# Altium schematic sheet 主控.SchDoc
size 381 x 241 mm
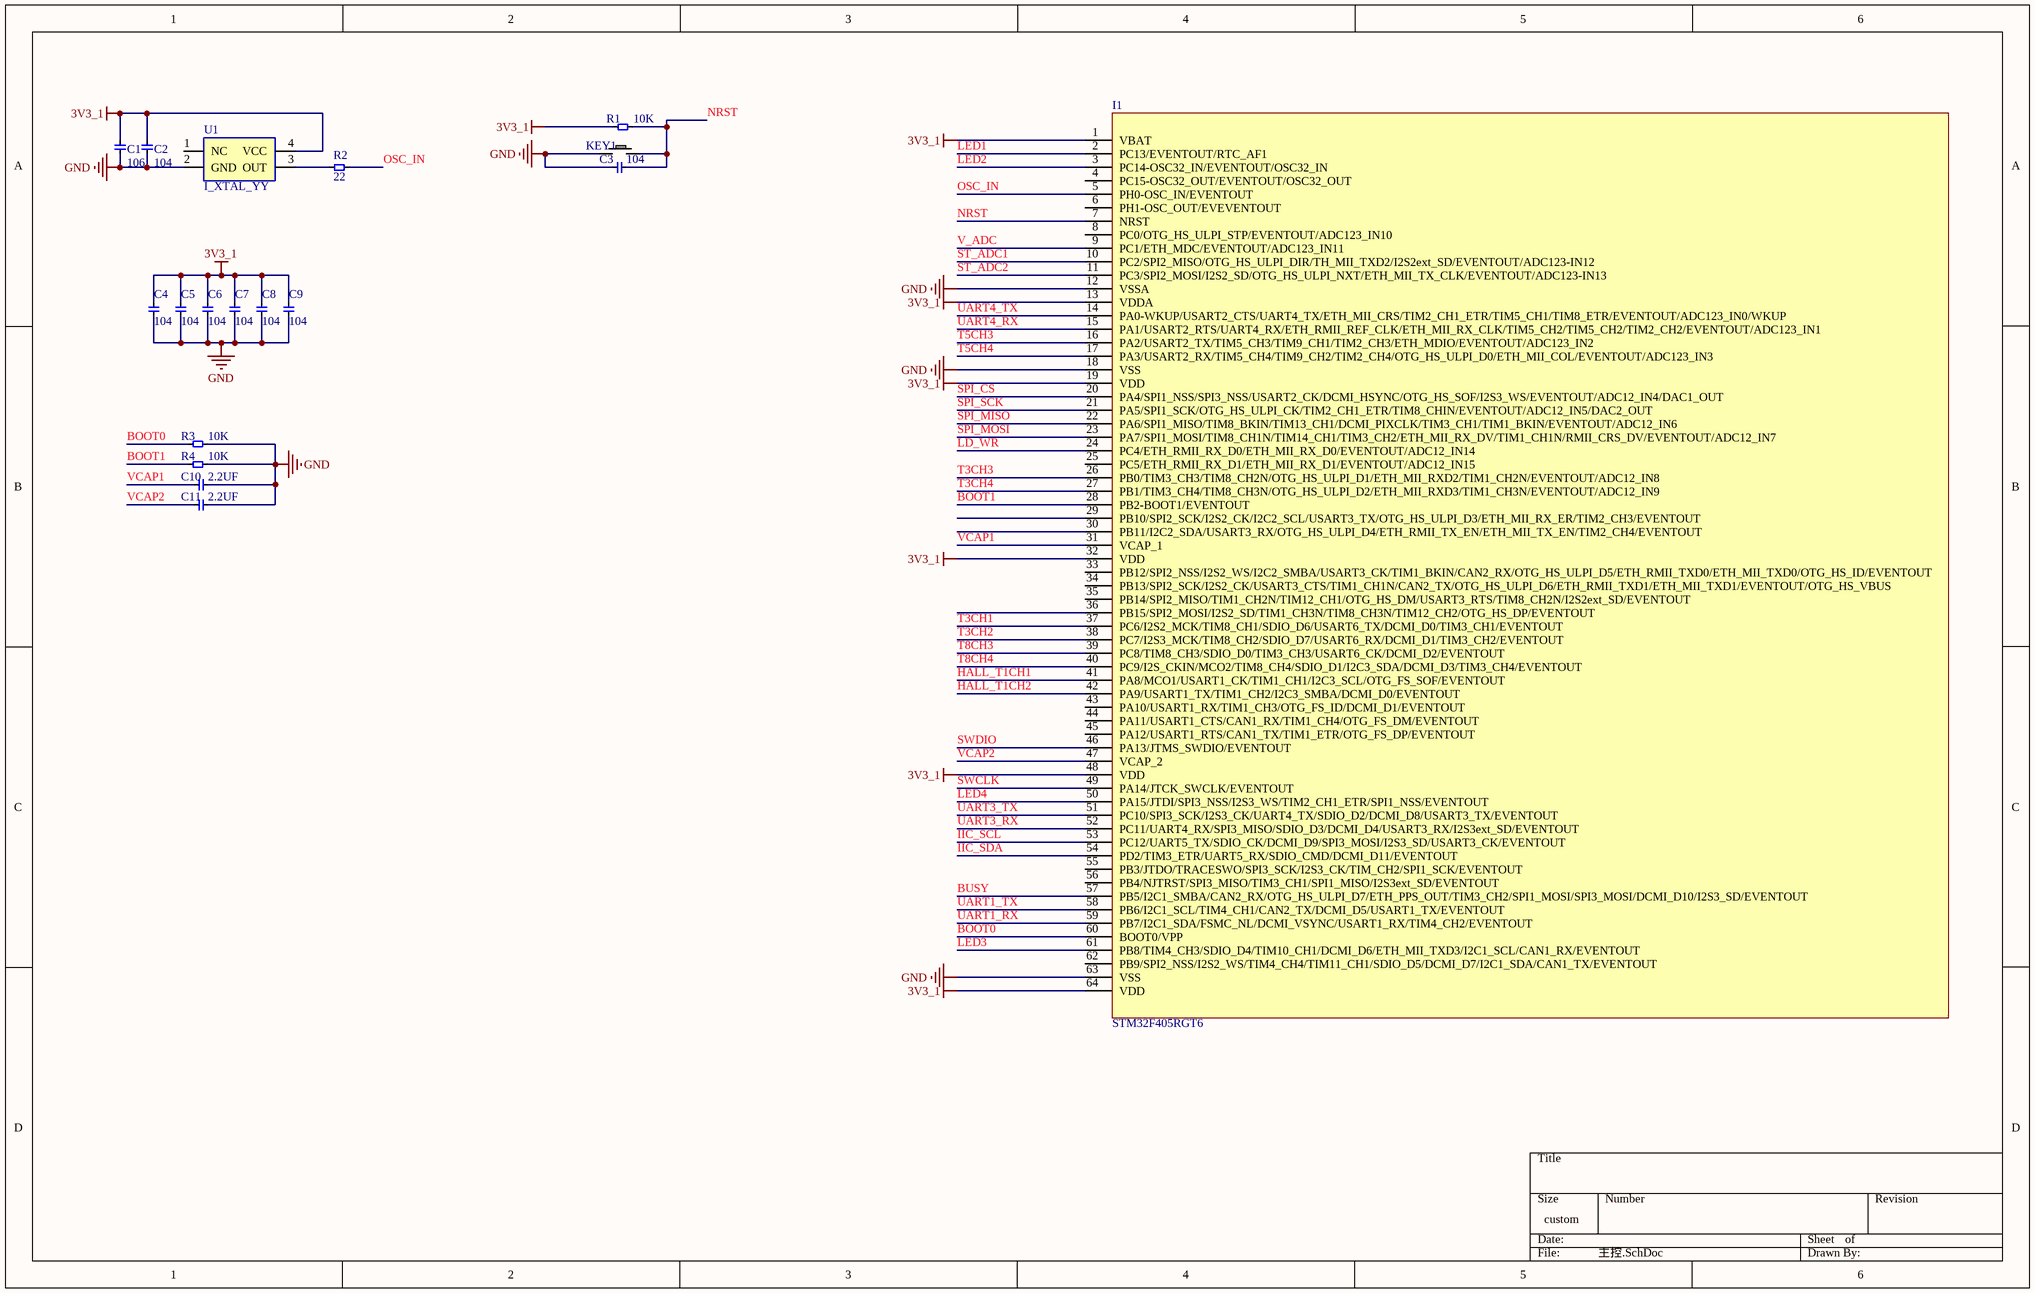
[diagram p0: 主控.SchDoc]

## Parts
C1  106  [C_0603]
C2  104  [C_0603]
C3  104  [C_0603]
C4  104  [C_0603]
C5  104  [C_0603]
C6  104  [C_0603]
C7  104  [C_0603]
C8  104  [C_0603]
C9  104  [C_0603]
C10  2.2UF  [C_0603]
C11  2.2UF  [C_0603]
I1  STM32F405RGT6  [I_LQFP-64]
KEY1  KEY  [按键_小四脚]  (value not drawn)
R1  10K  [R_0603]
R2  22  [R_0603]
R3  10K  [R_0603]
R4  10K  [R_0603]
U1  I_XTAL_YY  [I_XTAL_YYSMD_3.2X2.5]

## Nets
3V3_1: C1.2 C2.2 C4.2 C5.2 C6.2 C7.2 C8.2 C9.2 I1.1(VBAT) I1.13(VDDA) I1.19(VDD) I1.32(VDD) I1.48(VDD) I1.64(VDD) R1.1 U1.4(VCC)
GND: C1.1 C2.1 C3.2 C4.1 C5.1 C6.1 C7.1 C8.1 C9.1 C10.1 C11.1 I1.12(VSSA) I1.18(VSS) I1.63(VSS) KEY1.1 R3.2 R4.2 U1.2(GND)
BOOT0: I1.60(BOOT0/VPP) R3.1
BOOT1: I1.28(PB2-BOOT1/EVENTOUT) R4.1
BUSY: I1.57(PB5/I2C1_SMBA/CAN2_RX/OTG_HS_ULPI_D7/ETH_PPS_OUT/TIM3_CH2/SPI1_MOSI/SPI3_MOSI/DCMI_D10/I2S3_SD/EVENTOUT)
HALL_T1CH1: I1.41(PA8/MCO1/USART1_CK/TIM1_CH1/I2C3_SCL/OTG_FS_SOF/EVENTOUT)
HALL_T1CH2: I1.42(PA9/USART1_TX/TIM1_CH2/I2C3_SMBA/DCMI_D0/EVENTOUT)
IIC_SCL: I1.53(PC12/UART5_TX/SDIO_CK/DCMI_D9/SPI3_MOSI/I2S3_SD/USART3_CK/EVENTOUT)
IIC_SDA: I1.54(PD2/TIM3_ETR/UART5_RX/SDIO_CMD/DCMI_D11/EVENTOUT)
LD_WR: I1.24(PC4/ETH_RMII_RX_D0/ETH_MII_RX_D0/EVENTOUT/ADC12_IN14)
LED1: I1.2(PC13/EVENTOUT/RTC_AF1)
LED2: I1.3(PC14-OSC32_IN/EVENTOUT/OSC32_IN)
LED3: I1.61(PB8/TIM4_CH3/SDIO_D4/TIM10_CH1/DCMI_D6/ETH_MII_TXD3/I2C1_SCL/CAN1_RX/EVENTOUT)
LED4: I1.50(PA15/JTDI/SPI3_NSS/I2S3_WS/TIM2_CH1_ETR/SPI1_NSS/EVENTOUT)
NRST: C3.1 I1.7(NRST) KEY1.2 R1.2
OSC_IN: I1.5(PH0-OSC_IN/EVENTOUT) R2.2
SPI_CS: I1.20(PA4/SPI1_NSS/SPI3_NSS/USART2_CK/DCMI_HSYNC/OTG_HS_SOF/I2S3_WS/EVENTOUT/ADC12_IN4/DAC1_OUT)
SPI_MISO: I1.22(PA6/SPI1_MISO/TIM8_BKIN/TIM13_CH1/DCMI_PIXCLK/TIM3_CH1/TIM1_BKIN/EVENTOUT/ADC12_IN6)
SPI_MOSI: I1.23(PA7/SPI1_MOSI/TIM8_CH1N/TIM14_CH1/TIM3_CH2/ETH_MII_RX_DV/TIM1_CH1N/RMII_CRS_DV/EVENTOUT/ADC12_IN7)
SPI_SCK: I1.21(PA5/SPI1_SCK/OTG_HS_ULPI_CK/TIM2_CH1_ETR/TIM8_CHIN/EVENTOUT/ADC12_IN5/DAC2_OUT)
ST_ADC1: I1.10(PC2/SPI2_MISO/OTG_HS_ULPI_DIR/TH_MII_TXD2/I2S2ext_SD/EVENTOUT/ADC123-IN12)
ST_ADC2: I1.11(PC3/SPI2_MOSI/I2S2_SD/OTG_HS_ULPI_NXT/ETH_MII_TX_CLK/EVENTOUT/ADC123-IN13)
SWCLK: I1.49(PA14/JTCK_SWCLK/EVENTOUT)
SWDIO: I1.46(PA13/JTMS_SWDIO/EVENTOUT)
T3CH1: I1.37(PC6/I2S2_MCK/TIM8_CH1/SDIO_D6/USART6_TX/DCMI_D0/TIM3_CH1/EVENTOUT)
T3CH2: I1.38(PC7/I2S3_MCK/TIM8_CH2/SDIO_D7/USART6_RX/DCMI_D1/TIM3_CH2/EVENTOUT)
T3CH3: I1.26(PB0/TIM3_CH3/TIM8_CH2N/OTG_HS_ULPI_D1/ETH_MII_RXD2/TIM1_CH2N/EVENTOUT/ADC12_IN8)
T3CH4: I1.27(PB1/TIM3_CH4/TIM8_CH3N/OTG_HS_ULPI_D2/ETH_MII_RXD3/TIM1_CH3N/EVENTOUT/ADC12_IN9)
T5CH3: I1.16(PA2/USART2_TX/TIM5_CH3/TIM9_CH1/TIM2_CH3/ETH_MDIO/EVENTOUT/ADC123_IN2)
T5CH4: I1.17(PA3/USART2_RX/TIM5_CH4/TIM9_CH2/TIM2_CH4/OTG_HS_ULPI_D0/ETH_MII_COL/EVENTOUT/ADC123_IN3)
T8CH3: I1.39(PC8/TIM8_CH3/SDIO_D0/TIM3_CH3/USART6_CK/DCMI_D2/EVENTOUT)
T8CH4: I1.40(PC9/I2S_CKIN/MCO2/TIM8_CH4/SDIO_D1/I2C3_SDA/DCMI_D3/TIM3_CH4/EVENTOUT)
UART1_RX: I1.59(PB7/I2C1_SDA/FSMC_NL/DCMI_VSYNC/USART1_RX/TIM4_CH2/EVENTOUT)
UART1_TX: I1.58(PB6/I2C1_SCL/TIM4_CH1/CAN2_TX/DCMI_D5/USART1_TX/EVENTOUT)
UART3_RX: I1.52(PC11/UART4_RX/SPI3_MISO/SDIO_D3/DCMI_D4/USART3_RX/I2S3ext_SD/EVENTOUT)
UART3_TX: I1.51(PC10/SPI3_SCK/I2S3_CK/UART4_TX/SDIO_D2/DCMI_D8/USART3_TX/EVENTOUT)
UART4_RX: I1.15(PA1/USART2_RTS/UART4_RX/ETH_RMII_REF_CLK/ETH_MII_RX_CLK/TIM5_CH2/TIM5_CH2/TIM2_CH2/EVENTOUT/ADC123_IN1)
UART4_TX: I1.14(PA0-WKUP/USART2_CTS/UART4_TX/ETH_MII_CRS/TIM2_CH1_ETR/TIM5_CH1/TIM8_ETR/EVENTOUT/ADC123_IN0/WKUP)
V_ADC: I1.9(PC1/ETH_MDC/EVENTOUT/ADC123_IN11)
VCAP1: C10.2 I1.31(VCAP_1)
VCAP2: C11.2 I1.47(VCAP_2)
NetR2_1: R2.1 U1.3(OUT)

Not connected (* = marked no-connect by the designer): I1 4(PC15-OSC32_OUT/EVENTOUT/OSC32_OUT) 6(PH1-OSC_OUT/EVEVENTOUT) 8(PC0/OTG_HS_ULPI_STP/EVENTOUT/ADC123_IN10) 25(PC5/ETH_RMII_RX_D1/ETH_MII_RX_D1/EVENTOUT/ADC12_IN15) 29(PB10/SPI2_SCK/I2S2_CK/I2C2_SCL/USART3_TX/OTG_HS_ULPI_D3/ETH_MII_RX_ER/TIM2_CH3/EVENTOUT) 30(PB11/I2C2_SDA/USART3_RX/OTG_HS_ULPI_D4/ETH_RMII_TX_EN/ETH_MII_TX_EN/TIM2_CH4/EVENTOUT) 33(PB12/SPI2_NSS/I2S2_WS/I2C2_SMBA/USART3_CK/TIM1_BKIN/CAN2_RX/OTG_HS_ULPI_D5/ETH_RMII_TXD0/ETH_MII_TXD0/OTG_HS_ID/EVENTOUT) 34(PB13/SPI2_SCK/I2S2_CK/USART3_CTS/TIM1_CH1N/CAN2_TX/OTG_HS_ULPI_D6/ETH_RMII_TXD1/ETH_MII_TXD1/EVENTOUT/OTG_HS_VBUS) 35(PB14/SPI2_MISO/TIM1_CH2N/TIM12_CH1/OTG_HS_DM/USART3_RTS/TIM8_CH2N/I2S2ext_SD/EVENTOUT) 36(PB15/SPI2_MOSI/I2S2_SD/TIM1_CH3N/TIM8_CH3N/TIM12_CH2/OTG_HS_DP/EVENTOUT) 43(PA10/USART1_RX/TIM1_CH3/OTG_FS_ID/DCMI_D1/EVENTOUT) 44(PA11/USART1_CTS/CAN1_RX/TIM1_CH4/OTG_FS_DM/EVENTOUT) 45(PA12/USART1_RTS/CAN1_TX/TIM1_ETR/OTG_FS_DP/EVENTOUT) 55(PB3/JTDO/TRACESWO/SPI3_SCK/I2S3_CK/TIM_CH2/SPI1_SCK/EVENTOUT) 56(PB4/NJTRST/SPI3_MISO/TIM3_CH1/SPI1_MISO/I2S3ext_SD/EVENTOUT) 62(PB9/SPI2_NSS/I2S2_WS/TIM4_CH4/TIM11_CH1/SDIO_D5/DCMI_D7/I2C1_SDA/CAN1_TX/EVENTOUT); U1 1(NC)

## Library data of the parts
C1-C11 = C_无极贴片: 无极性贴片电容
I1 = I_STM32F405RGT6: LQFP-64
KEY1 = 按键
R1-R4 = R_贴片: 贴片电阻
U1 = I_XTAL_YY: 有源晶振